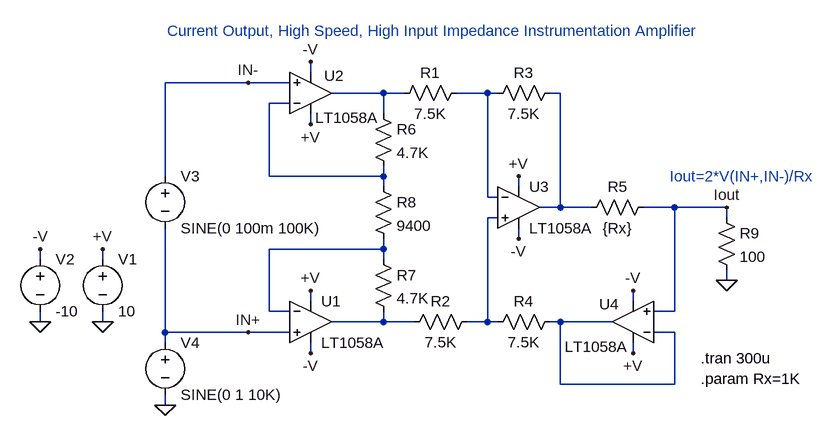
[diagram p0: schematic LT1058A.asc]
LT1058A.asc, the LTspice schematic file:
Version 4
SHEET 1 920 680
WIRE 96 -80 96 -96
WIRE 0 -64 -128 -64
WIRE 64 -64 0 -64
WIRE 208 -48 128 -48
WIRE 240 -48 208 -48
WIRE 368 -48 320 -48
WIRE 384 -48 368 -48
WIRE 480 -48 464 -48
WIRE 64 -32 32 -32
WIRE 208 -16 208 -48
WIRE 96 0 96 -16
WIRE -128 80 -128 -64
WIRE 32 80 32 -32
WIRE 208 80 208 64
WIRE 208 80 32 80
WIRE 208 96 208 80
WIRE 416 96 416 80
WIRE 368 112 368 -48
WIRE 384 112 368 112
WIRE 480 128 480 -48
WIRE 480 128 448 128
WIRE 528 128 480 128
WIRE 656 128 608 128
WIRE 736 128 656 128
WIRE 384 144 368 144
WIRE 736 144 736 128
WIRE 416 176 416 160
WIRE 208 192 208 176
WIRE 208 192 32 192
WIRE -320 208 -320 192
WIRE -224 208 -224 192
WIRE 208 208 208 192
WIRE 736 240 736 224
WIRE 96 272 96 256
WIRE 592 272 592 256
WIRE 32 288 32 192
WIRE 64 288 32 288
WIRE 656 288 656 128
WIRE 656 288 624 288
WIRE -320 304 -320 288
WIRE -224 304 -224 288
WIRE 208 304 208 288
WIRE 208 304 128 304
WIRE 256 304 208 304
WIRE 368 304 368 144
WIRE 368 304 336 304
WIRE 384 304 368 304
WIRE 480 304 464 304
WIRE 560 304 480 304
WIRE -128 320 -128 160
WIRE 0 320 -128 320
WIRE 64 320 0 320
WIRE 656 320 624 320
WIRE -128 336 -128 320
WIRE 96 352 96 336
WIRE 592 352 592 336
WIRE 480 400 480 304
WIRE 656 400 656 320
WIRE 656 400 480 400
WIRE -128 432 -128 416
FLAG -224 304 0
FLAG 96 256 +V
FLAG -224 192 +V
FLAG 96 352 -V
FLAG -320 304 0
FLAG -320 192 -V
FLAG 96 0 +V
FLAG 96 -96 -V
FLAG 416 80 +V
FLAG 416 176 -V
FLAG 592 352 +V
FLAG 592 256 -V
FLAG -128 432 0
FLAG 736 240 0
FLAG 736 128 Iout
FLAG 0 320 IN+
FLAG 0 -64 IN-
SYMBOL voltage -224 192 R0
SYMATTR InstName V1
SYMATTR Value 10
SYMBOL voltage -320 192 R0
SYMATTR InstName V2
SYMATTR Value -10
SYMBOL res 336 -64 R90
WINDOW 0 0 56 VBottom 2
WINDOW 3 32 56 VTop 2
SYMATTR InstName R1
SYMATTR Value 7.5K
SYMBOL res 352 288 R90
WINDOW 0 0 56 VBottom 2
WINDOW 3 32 56 VTop 2
SYMATTR InstName R2
SYMATTR Value 7.5K
SYMBOL res 480 -64 R90
WINDOW 0 0 56 VBottom 2
WINDOW 3 32 56 VTop 2
SYMATTR InstName R3
SYMATTR Value 7.5K
SYMBOL res 480 288 R90
WINDOW 0 0 56 VBottom 2
WINDOW 3 32 56 VTop 2
SYMATTR InstName R4
SYMATTR Value 7.5K
SYMBOL res 624 112 R90
WINDOW 0 0 56 VBottom 2
WINDOW 3 32 56 VTop 2
SYMATTR InstName R5
SYMATTR Value {Rx}
SYMBOL res 192 -32 R0
SYMATTR InstName R6
SYMATTR Value 4.7K
SYMBOL res 192 192 R0
SYMATTR InstName R7
SYMATTR Value 4.7K
SYMBOL res 192 80 R0
SYMATTR InstName R8
SYMATTR Value 9400
SYMBOL voltage -128 64 R0
SYMATTR InstName V3
SYMATTR Value SINE(0 100m 100K)
SYMBOL voltage -128 320 R0
SYMATTR InstName V4
SYMATTR Value SINE(0 1 10K)
SYMBOL res 720 128 R0
SYMATTR InstName R9
SYMATTR Value 100
SYMBOL opamps\\LT1058A 96 240 R0
SYMATTR InstName U1
SYMBOL opamps\\LT1058A 96 16 M180
WINDOW 0 21 91 Left 2
WINDOW 3 7 26 Left 2
SYMATTR InstName U2
SYMBOL opamps\\LT1058A 416 64 R0
SYMATTR InstName U3
SYMBOL opamps\\LT1058A 592 368 R180
WINDOW 0 21 91 Left 2
WINDOW 3 7 26 Left 2
SYMATTR InstName U4
TEXT 696 360 Left 2 !.tran 300u\n.param Rx=1K
TEXT 648 80 Left 2 ;Iout=2*V(IN+,IN-)/Rx
TEXT 288 -128 Bottom 2 ;Current Output, High Speed, High Input Impedance Instrumentation Amplifier

The netlist it stands for:
* LT1058A.asc
V1 +V 0 10
V2 -V 0 -10
R1 N002 N001 7.5K
R2 N005 N007 7.5K
R3 N003 N002 7.5K
R4 N008 N005 7.5K
R5 Iout N003 {Rx}
R6 N001 N004 4.7K
R7 N006 N007 4.7K
R8 N004 N006 9400
V3 IN- IN+ SINE(0 100m 100K)
V4 IN+ 0 SINE(0 1 10K)
R9 Iout 0 100
XU1 IN+ N006 +V -V N007 LT1058A  ; pins In+ In- V+ V- OUT
XU2 IN- N004 +V -V N001 LT1058A  ; pins In+ In- V+ V- OUT
XU3 N005 N002 +V -V N003 LT1058A  ; pins In+ In- V+ V- OUT
XU4 Iout N008 +V -V N008 LT1058A  ; pins In+ In- V+ V- OUT
.tran 300u
.param Rx=1K
* Iout=2*V(IN+,IN-)/Rx
* Current Output, High Speed, High Input Impedance Instrumentation Amplifier
.backanno
.end